# EAGLE board csa_ultrabus_v2 (EAGLE 6.4), part 1 of 2
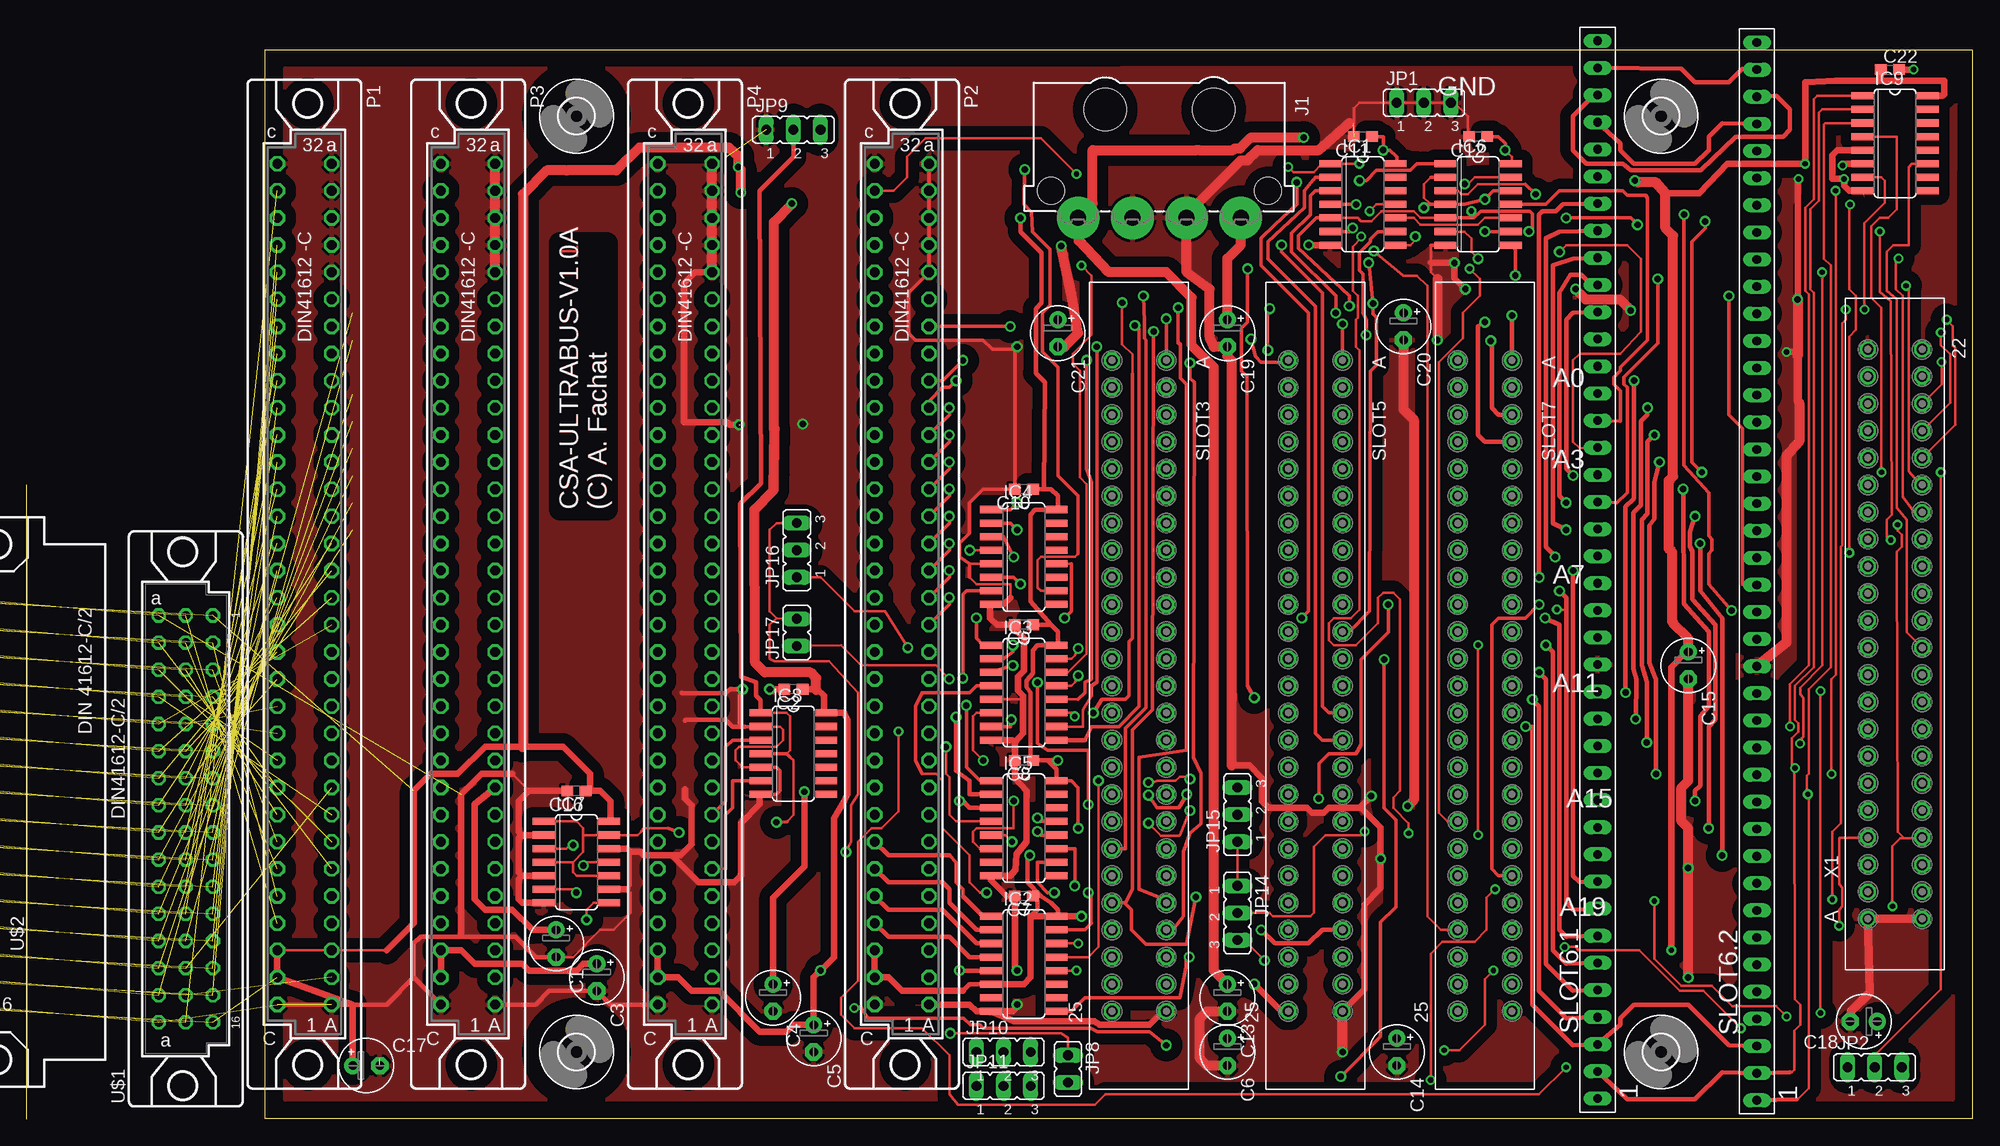
[diagram p5: board, top side]
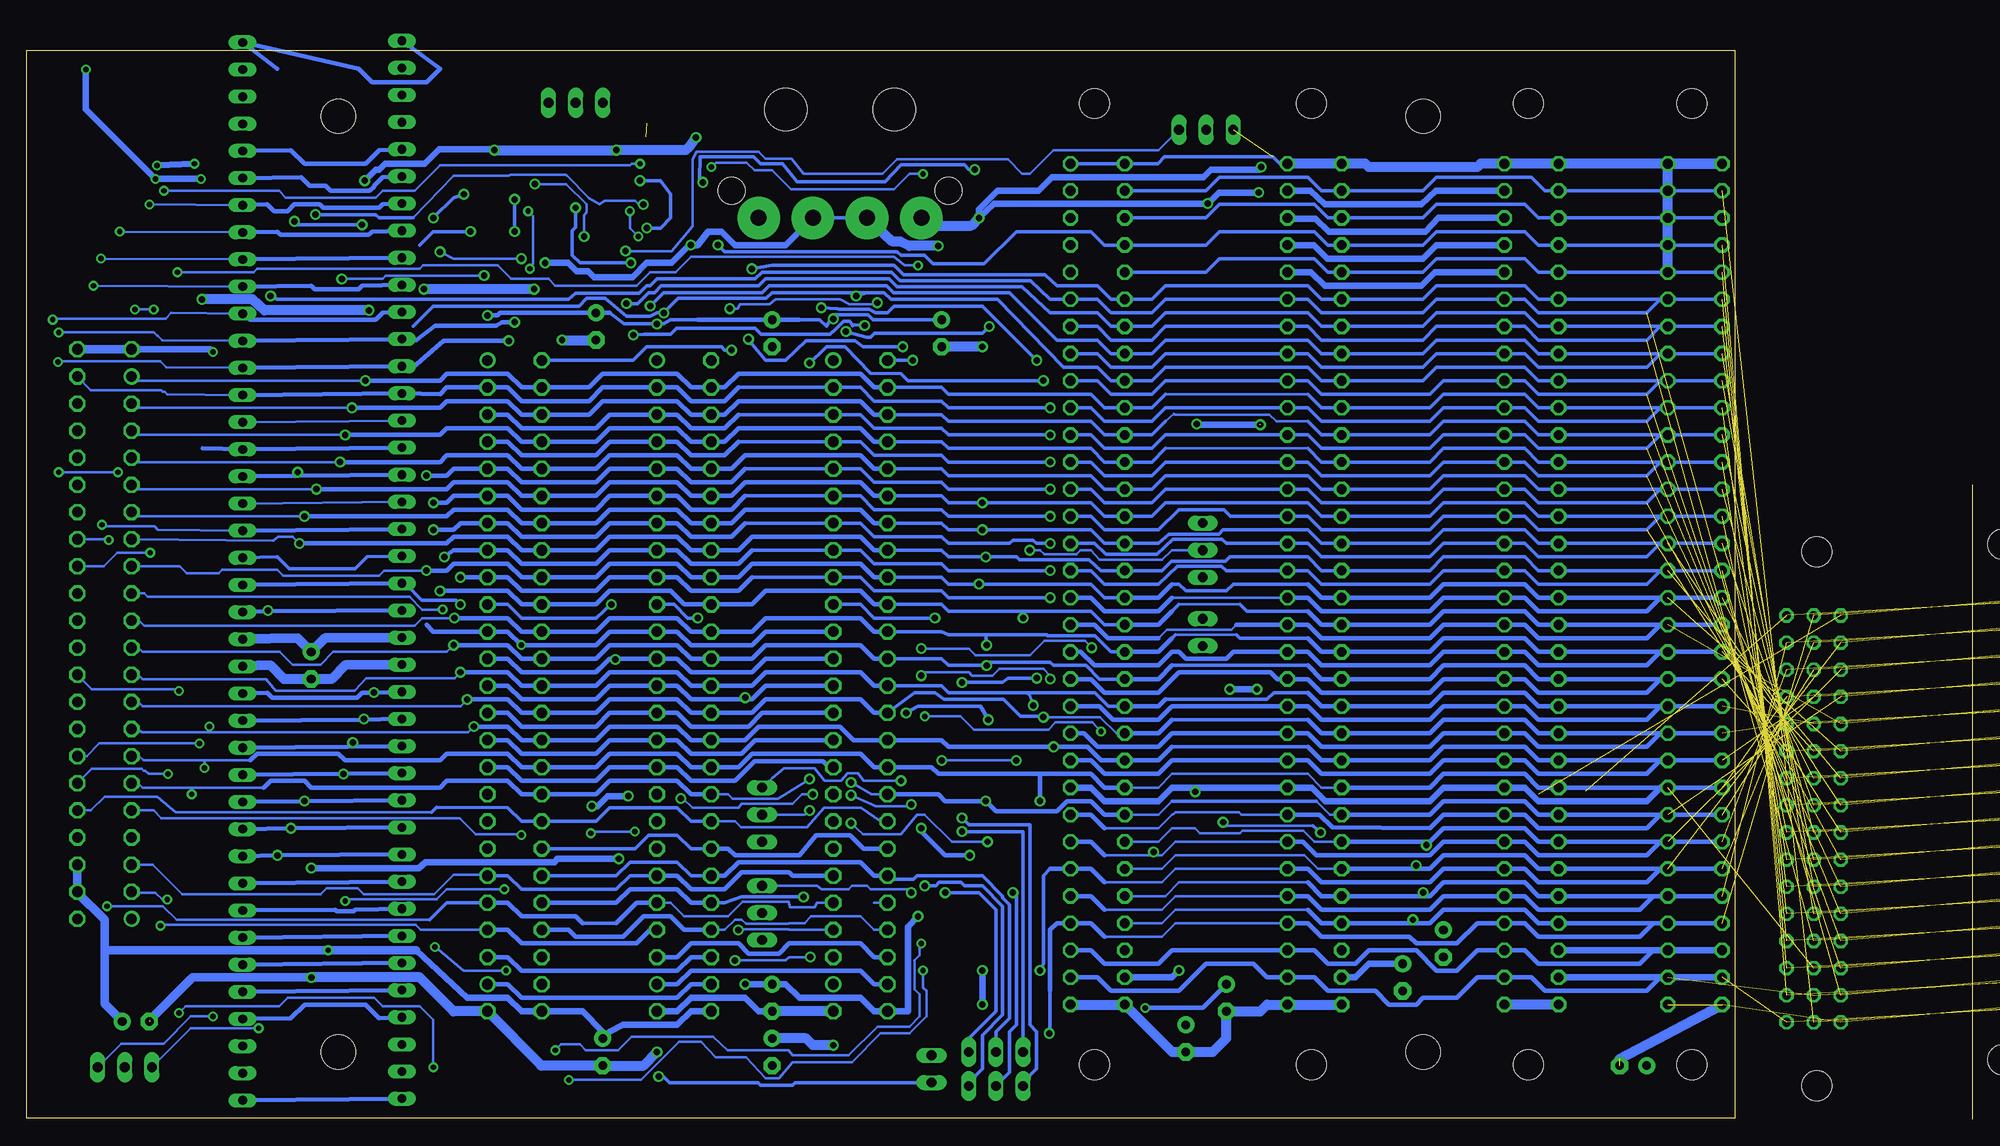
[diagram p6: board, bottom side, seen from below]

Size 160 x 100 mm. Coordinates in mm from the lower left corner, seen from the top.
Outline: 0,0 160,0 160,100 0,100 0,0
Copper layers (1*16): Top 0.035mm / dielectric 1.5mm / Bottom 0.035mm
Design rules "default *": minimum track width 10mil, minimum drill 0.3mm, track to track 6mil, track to pad 6mil, pad to pad 6mil, via to via 6mil, smd to smd 6mil, copper to edge 40mil, drill to drill 8mil, minimum pad ring 10mil, minimum via ring 8mil, stop-mask expansion 4mil, vias tented up to drill 0mil, thermal gap 10mil

## Footprints (pad centres in the part's own frame; a part is rotated, then mirrored left to right if it is on the bottom)
E2,5-5 = drill 0.813 pad 1.6: + -1.27,0 | drill 0.813 pad 1.6 octagon: - 1.27,0
C0603 = smd 1.1 x 1: 1 -0.85,0; 2 0.85,0
3,2 = hole 3.2: 0,0
SO14 = smd 0.66 x 2.032: 1 -3.81,-3.073; 2 -2.54,-3.073; 3 -1.27,-3.073; 4 0,-3.073; 5 1.27,-3.073; 6 2.54,-3.073; 7 3.81,-3.073; 8 3.81,3.073; 9 2.54,3.073; 10 1.27,3.073; 11 0,3.073; 12 -1.27,3.073; 13 -2.54,3.073; 14 -3.81,3.073
SO16 = smd 0.66 x 2.032: 1 -4.445,-3.073; 2 -3.175,-3.073; 3 -1.905,-3.073; 4 -0.635,-3.073; 5 0.635,-3.073; 6 1.905,-3.073; 7 3.175,-3.073; 8 4.445,-3.073; 9 4.445,3.073; 10 3.175,3.073; 11 1.905,3.073; 12 0.635,3.073; 13 -0.635,3.073; 14 -1.905,3.073; 15 -3.175,3.073; 16 -4.445,3.073
827001 = drill 1.5 pad 4: 1 -7.62,0; 2 -2.54,0; 3 2.54,0; 4 7.62,0 | hole 4: 5.08,-10.16; -5.08,-10.16 | hole 2.5: 10.16,-2.54; -10.16,-2.54
JP2 = drill 0.914 long: 1 -2.54,0; 2 0,0; 3 2.54,0
JP1 = drill 0.914 long: 1 0,-1.27; 2 0,1.27
CSABUSSOCK180 = drill 0.914 octagon: A1 -2.54,41.91; A2 -2.54,39.37; A3 -2.54,36.83; A4 -2.54,34.29; A5 -2.54,31.75; A6 -2.54,29.21; A7 -2.54,26.67; A8 -2.54,24.13; A9 -2.54,21.59; A10 -2.54,19.05; A11 -2.54,16.51; A12 -2.54,13.97; A13 -2.54,11.43; A14 -2.54,8.89; A15 -2.54,6.35; A16 -2.54,3.81; A17 -2.54,1.27; A18 -2.54,-1.27; A19 -2.54,-3.81; A20 -2.54,-6.35; A21 -2.54,-8.89; A22 -2.54,-11.43; A23 -2.54,-13.97; A24 -2.54,-16.51; A25 -2.54,-19.05; A26 -2.54,-21.59; A27 -2.54,-24.13; A28 -2.54,-26.67; A29 -2.54,-29.21; A30 -2.54,-31.75; A31 -2.54,-34.29; A32 -2.54,-36.83; C1 2.54,41.91; C2 2.54,39.37; C3 2.54,36.83; C4 2.54,34.29; C5 2.54,31.75; C6 2.54,29.21; C7 2.54,26.67; C8 2.54,24.13; C9 2.54,21.59; C10 2.54,19.05; C11 2.54,16.51; C12 2.54,13.97; C13 2.54,11.43; C14 2.54,8.89; C15 2.54,6.35; C16 2.54,3.81; C17 2.54,1.27; C18 2.54,-1.27; C19 2.54,-3.81; C20 2.54,-6.35; C21 2.54,-8.89; C22 2.54,-11.43; C23 2.54,-13.97; C24 2.54,-16.51; C25 2.54,-19.05; C26 2.54,-21.59; C27 2.54,-24.13; C28 2.54,-26.67; C29 2.54,-29.21; C30 2.54,-31.75; C31 2.54,-34.29; C32 2.54,-36.83 | hole 2.794: -0.305,47.549; -0.305,-42.469
FE100-25 = drill 1 octagon: 1 -29.21,-2.54; 2 -26.67,-2.54; 3 -24.13,-2.54; 4 -21.59,-2.54; 5 -19.05,-2.54; 6 -16.51,-2.54; 7 -13.97,-2.54; 8 -11.43,-2.54; 9 -8.89,-2.54; 10 -6.35,-2.54; 11 -3.81,-2.54; 12 -1.27,-2.54; 13 1.27,-2.54; 14 3.81,-2.54; 15 6.35,-2.54; 16 8.89,-2.54; 17 11.43,-2.54; 18 13.97,-2.54; 19 16.51,-2.54; 20 19.05,-2.54; 21 21.59,-2.54; 22 24.13,-2.54; 23 26.67,-2.54; 24 29.21,-2.54; 25 31.75,-2.54; B -26.67,2.54; C -24.13,2.54; D -21.59,2.54; E -19.05,2.54; F -16.51,2.54; G -13.97,2.54; H -11.43,2.54; J -8.89,2.54; K -6.35,2.54; L -3.81,2.54; M -1.27,2.54; N 1.27,2.54; O 3.81,2.54; P 6.35,2.54; Q 8.89,2.54; R 11.43,2.54; S 13.97,2.54; T 16.51,2.54; U 19.05,2.54; V 21.59,2.54; W 24.13,2.54; X 26.67,2.54; Z 31.75,2.54 | drill 1: A -29.21,2.54; Y 29.21,2.54
SIL40 = drill 0.813 long: 1 -27.94,-1.27; 2 -25.4,-1.27; 3 -22.86,-1.27; 4 -20.32,-1.27; 5 -17.78,-1.27; 6 -15.24,-1.27; 7 -12.7,-1.27; 8 -10.16,-1.27; 9 -7.62,-1.27; 10 -5.08,-1.27; 11 -2.54,-1.27; 12 0,-1.27; 13 2.54,-1.27; 14 5.08,-1.27; 15 7.62,-1.27; 16 10.16,-1.27; 17 12.7,-1.27; 18 15.24,-1.27; 19 17.78,-1.27; 20 20.32,-1.27; 21 22.86,-1.27; 22 25.4,-1.27; 23 27.94,-1.27; 24 30.48,-1.27; 25 33.02,-1.27; 26 35.56,-1.27; 27 38.1,-1.27; 28 40.64,-1.27; 29 43.18,-1.27; 30 45.72,-1.27; 31 48.26,-1.27; 32 50.8,-1.27; 33 53.34,-1.27; 34 55.88,-1.27; 35 58.42,-1.27; 36 60.96,-1.27; 37 63.5,-1.27; 38 66.04,-1.27; 39 68.58,-1.27; 40 71.12,-1.27
FABC48S2 = drill 0.813 octagon: A1 -2.54,19.05; A2 -2.54,16.51; A3 -2.54,13.97; A4 -2.54,11.43; A5 -2.54,8.89; A6 -2.54,6.35; A7 -2.54,3.81; A8 -2.54,1.27; A9 -2.54,-1.27; A10 -2.54,-3.81; A11 -2.54,-6.35; A12 -2.54,-8.89; A13 -2.54,-11.43; A14 -2.54,-13.97; A15 -2.54,-16.51; A16 -2.54,-19.05; B1 0,19.05; B2 0,16.51; B3 0,13.97; B4 0,11.43; B5 0,8.89; B6 0,6.35; B7 0,3.81; B8 0,1.27; B9 0,-1.27; B10 0,-3.81; B11 0,-6.35; B12 0,-8.89; B13 0,-11.43; B14 0,-13.97; B15 0,-16.51; B16 0,-19.05; C1 2.54,19.05; C2 2.54,16.51; C3 2.54,13.97; C4 2.54,11.43; C5 2.54,8.89; C6 2.54,6.35; C7 2.54,3.81; C8 2.54,1.27; C9 2.54,-1.27; C10 2.54,-3.81; C11 2.54,-6.35; C12 2.54,-8.89; C13 2.54,-11.43; C14 2.54,-13.97; C15 2.54,-16.51; C16 2.54,-19.05 | hole 2.794: -0.305,-25; -0.305,25
MABC48B2 = drill 1.016 octagon: A1 -5.08,19.05; A2 -5.08,16.51; A3 -5.08,13.97; A4 -5.08,11.43; A5 -5.08,8.89; A6 -5.08,6.35; A7 -5.08,3.81; A8 -5.08,1.27; A9 -5.08,-1.27; A10 -5.08,-3.81; A11 -5.08,-6.35; A12 -5.08,-8.89; A13 -5.08,-11.43; A14 -5.08,-13.97; A15 -5.08,-16.51; A16 -5.08,-19.05; B1 -7.62,19.05; B2 -7.62,16.51; B3 -7.62,13.97; B4 -7.62,11.43; B5 -7.62,8.89; B6 -7.62,6.35; B7 -7.62,3.81; B8 -7.62,1.27; B9 -7.62,-1.27; B10 -7.62,-3.81; B11 -7.62,-6.35; B12 -7.62,-8.89; B13 -7.62,-11.43; B14 -7.62,-13.97; B15 -7.62,-16.51; B16 -7.62,-19.05; C1 -10.16,19.05; C2 -10.16,16.51; C3 -10.16,13.97; C4 -10.16,11.43; C5 -10.16,8.89; C6 -10.16,6.35; C7 -10.16,3.81; C8 -10.16,1.27; C9 -10.16,-1.27; C10 -10.16,-3.81; C11 -10.16,-6.35; C12 -10.16,-8.89; C13 -10.16,-11.43; C14 -10.16,-13.97; C15 -10.16,-16.51; C16 -10.16,-19.05 | hole 2.794: -2.54,24.13; -2.54,-24.13
FE100-22-2 = drill 1 octagon: 1 -26.67,-2.54; 2 -24.13,-2.54; 3 -21.59,-2.54; 4 -19.05,-2.54; 5 -16.51,-2.54; 6 -13.97,-2.54; 7 -11.43,-2.54; 8 -8.89,-2.54; 9 -6.35,-2.54; 10 -3.81,-2.54; 11 -1.27,-2.54; 12 1.27,-2.54; 13 3.81,-2.54; 14 6.35,-2.54; 15 8.89,-2.54; 16 11.43,-2.54; 17 13.97,-2.54; 18 16.51,-2.54; 19 19.05,-2.54; 20 21.59,-2.54; 21 24.13,-2.54; 22 26.67,-2.54; B -24.13,2.54; C -21.59,2.54; D -19.05,2.54; E -16.51,2.54; F -13.97,2.54; H -11.43,2.54; J -8.89,2.54; K -6.35,2.54; L -3.81,2.54; M -1.27,2.54; N 1.27,2.54; P 3.81,2.54; R 6.35,2.54; S 8.89,2.54; T 11.43,2.54; U 13.97,2.54; V 16.51,2.54; W 19.05,2.54; X 21.59,2.54; Z 26.67,2.54 | drill 1: A -26.67,2.54; Y 24.13,2.54

## Placement (x,y rotation side)
C1  47u  [E2,5-5]  27.3,16.34 270 top
C2  [C0603]  49.53,40.16 180 top
C3  47u  [E2,5-5]  31.11,13.17 270 top
C4  47u  [E2,5-5]  47.62,11.27 270 top
C5  47u  [E2,5-5]  51.43,7.46 270 top
C6  47u  [E2,5-5]  90.16,6.18 270 top
C7  [C0603]  71.11,20.79 180 top
C8  [C0603]  71.11,33.49 180 top
C9  [C0603]  71.11,46.19 180 top
C10  [C0603]  71.11,58.89 180 top
C11  [C0603]  102.86,91.91 180 top
C12  [C0603]  113.66,91.91 180 top
C13  47u  [E2,5-5]  90.16,11.27 270 top
C14  47u  [E2,5-5]  106.04,6.18 270 top
C15  47u  [E2,5-5]  133.34,42.38 270 top
C16  [C0603]  29.2,30.63 180 top
C17  47u  [E2,5-5]  9.52,4.92 0 top
C18  47u  [E2,5-5]  149.78,9.04 180 top
C19  47u  [E2,5-5]  90.16,73.5 270 top
C20  47u  [E2,5-5]  106.67,74.13 270 top
C21  47u  [E2,5-5]  74.29,73.5 270 top
C22  [C0603]  152.24,98.18 0 top
C23  47u  [E2,5-5]  -31.12,-3.18 0 top  (outside the outline)
C24  47u  [E2,5-5]  -31.12,-9.13 0 top  (outside the outline)
H1  MOUNT-HOLE3.2  [3,2]  29.2,93.81 0 top
H2  MOUNT-HOLE3.2  [3,2]  29.2,6.18 0 top
H3  MOUNT-HOLE3.2  [3,2]  130.81,93.81 0 top
H4  MOUNT-HOLE3.2  [3,2]  130.81,6.18 0 top
IC1  74AC04D  [SO14]  102.86,85.56 270 top
IC2  74AC138D  [SO16]  71.11,14.44 270 top
IC3  74AC138D  [SO16]  71.11,39.84 270 top
IC4  74AC138D  [SO16]  71.11,52.54 270 top
IC5  74AC138D  [SO16]  71.11,27.14 270 top
IC6  74HCT00D  [SO14]  113.66,85.56 270 top
IC7  74HCT125D  [SO14]  29.2,23.96 270 top
IC8  74HCT125D  [SO14]  49.53,34.12 270 top
IC9  74AC138D  [SO16]  152.71,91.28 270 top
J1  [827001]  83.81,84.29 180 top
JP1  [JP2]  108.58,95.08 0 top
JP2  [JP2]  150.81,4.76 0 top
JP8  [JP1]  75.24,4.6 180 top
JP9  [JP2]  49.53,92.55 0 top
JP10  [JP2]  69.21,6.18 0 top
JP11  [JP2]  69.21,3.01 0 top
JP14  [JP2]  91.12,19.2 270 top
JP15  [JP2]  91.12,28.41 90 top
JP16  [JP2]  49.84,53.17 90 top
JP17  [JP1]  49.84,45.48 0 top
P1  CSABUSSOCK180  [CSABUSSOCK180]  3.73,52.54 180 top
P2  CSABUSSOCK180  [CSABUSSOCK180]  59.69,52.54 180 top
P3  CSABUSSOCK180  [CSABUSSOCK180]  19.04,52.54 180 top
P4  CSABUSSOCK180  [CSABUSSOCK180]  39.37,52.54 180 top
SLOT3  A2SLOT  [FE100-25]  81.91,41.74 270 top
SLOT5  A2SLOT  [FE100-25]  98.42,41.74 270 top
SLOT6.1  RC2014/6502  [SIL40]  123.58,29.76 90 top
SLOT6.2  RC2014/6502  [SIL40]  138.5,29.6 90 top
SLOT7  A2SLOT  [FE100-25]  114.3,41.74 270 top
U$1  CSASHORTBUSFS  [FABC48S2]  -7.39,28.01 0 top  (outside the outline)
U$2  CSASHORTBUSMA  [MABC48B2]  -22.55,29.6 0 top  (outside the outline)
X1  PORT_EXPANSION_64_CONN  [FE100-22-2]  152.71,45.32 90 top

## Tracks (layer width: path | path; a pad name or v marks a point on that pad's centre or on a via)
8MHZ
  Top 0.305: IC1.2 98.42,88.1 97.39,86.83 97.39,85.24 93.97,82.07 93.97,80.48 98.42,76.03 98.42,36.03 99.05,35.39 SLOT5.P
  Bottom 0.406: SLOT3.P 91.75,35.39 93.02,34.12 97.78,34.12 99.05,35.39 SLOT5.P 105.41,35.39 106.67,34.12 113.66,34.12 114.93,35.39 SLOT7.P
12V  (via drill 0.6)
  Top 0.305: v100.96,74.37 SLOT5.A | SLOT3.A v84.45,74.84
  Top 0.406: v116.83,75.16 SLOT7.A
  Top 0.914: C19.+ 90.16,80.48 91.44,81.75 J1.1
  Bottom 0.305: C21.+ 80.72,74.77 81.2,75.24 84.45,75.24 | 97.15,74.77 99.69,74.77 100.32,74.37 v100.96,74.37 104.06,74.37 105.41,75.4 | 84.45,75.24 85.08,74.13 85.72,74.77 87.62,74.77 | v84.45,74.84 84.45,75.24
  Bottom 0.406: 87.62,74.77 C19.+ 97.15,74.77 | 105.41,75.4 C20.+ 115.64,75.4 115.88,75.16 v116.83,75.16
16MHZ
  Bottom 0.305: P1.C30 P3.C30 18.41,84.29 19.68,85.56 27.93,85.56 29.2,84.29 P4.C30 38.1,84.29 39.37,85.56 48.26,85.56 49.53,84.29 P2.C30
50HZ
  Bottom 0.406: P1.A3 7.62,15.71 8.89,14.44 18.41,14.44 19.68,15.71 P3.A3 24.12,15.71 26.03,13.81 27.93,13.81 29.84,15.71 34.29,15.71 35.55,14.44 38.1,14.44 39.37,15.71 P4.A3 52.7,15.71 53.97,14.44 59.05,14.44 60.32,15.71 P2.A3
/BANK0  (via drill 0.6)
  Top 0.254: 77.46,18.25 77.46,20.79 v77.15,21.11 | JP14.1 JP15.1
  Top 0.305: IC2.15 76.83,17.61 77.46,18.25
  Bottom 0.254: v77.15,21.11 77.46,21.42 80.96,21.42 81.27,21.74 82.7,21.74 83.02,21.42 85.56,21.42 85.96,21.74 JP14.1
/BANK1  (via drill 0.5)
  Top 0.254: IC2.14 v76.19,16.34 | v110.48,6.34 111.91,6.34 114.3,8.73 114.3,13.01 v115.09,13.81 | v121.76,16.03 122.87,16.03 123.03,15.71 128.74,15.71 132.55,11.9 134.77,11.9 v138.27,8.41
  Bottom 0.254: v76.19,16.34 76.35,16.34 76.35,15.23 76.83,14.76 76.83,12.06 76.35,11.58 76.35,9.52 77.31,8.57 80.32,8.57 83.02,5.87 88.26,5.87 88.66,6.34 94.37,6.34 95.72,7.61 103.34,7.61 104.61,6.34 107.63,6.34 108.18,6.9 109.93,6.9 v110.48,6.34 | v115.09,13.81 119.06,13.81 v121.76,16.03 | v138.27,8.41 144.62,8.41 JP2.1
/BANK2  (via drill 0.6)
  Top 0.254: IC2.13 77.15,15.08 78.1,16.03 v78.1,31.58
  Bottom 0.254: v78.1,31.58 81.59,31.58 82.15,32.3 83.1,32.3 83.74,31.58 85.24,31.58 86.2,32.78 89.05,32.78 90.16,31.82 JP15.3
/BANK3  (via drill 0.5)
  Top 0.254: IC2.12 v76.04,13.81 | v109.21,3.57 109.21,15.39 110.33,16.5 113.34,16.5 114.45,17.61 114.45,20.63 v115.25,21.42 | v130.17,20.31 130.17,14.92 132.71,12.38 135.57,12.38 137.47,10.47 141.6,10.47 v142.55,9.52
  Bottom 0.254: v76.04,13.81 76.04,12.22 75.72,11.9 75.72,9.52 77.31,7.93 80,7.93 82.7,5.23 88.26,5.23 89.53,3.72 90.8,3.72 92.63,5.71 95.48,5.71 96.83,7.14 98.9,7.14 102.47,3.57 v109.21,3.57 | v115.25,21.42 120.64,21.42 121.6,20.47 130.01,20.47 v130.17,20.31 | v142.55,9.52 144.62,9.52 147.16,6.98 151.12,6.98 JP2.3
/BANK6  (via drill 0.6)
  Top 0.254: v93.66,14.76 91.75,16.66 JP14.3
  Top 0.305: IC2.9 75.56,10 76.83,11.27 85.72,11.27 86.28,14.12 86.28,14.76 v86.59,15.08
  Bottom 0.254: v86.59,15.08 88.58,15.08 88.89,14.76 v93.66,14.76
/BE  (2 unrouted)
  Top 0.305: P4.A8 43.18,29.68 43.18,34.76 43.81,35.39 IC8.3
  Bottom 0.254: 59.05,27.14 53.97,27.14 52.7,28.41 52.54,28.49 52.38,28.65 46.43,28.65 46.19,28.41 P4.A8
  Bottom 0.406: P1.A8 6.98,28.41 8.25,27.14 18.41,27.14 19.68,28.41 P3.A8 27.3,28.41 28.57,27.14 37.7,27.22 38.89,28.41 P4.A8 | 59.05,27.14 60.32,28.41 P2.A8
/DMA  (via drill 0.6)
  Top 0.254: SLOT7.22 110.17,17.61 108.9,18.88 108.9,77.94 107.94,78.89 106.67,78.89 v103.9,81.19
  Bottom 0.254: SLOT3.22 80.64,17.61 81.91,18.88 86.51,18.88 87.15,18.25 88.58,18.25 88.66,18.17 92.63,18.17 93.02,18.57 93.66,18.57 94.61,17.61 SLOT5.22 | v103.9,81.19 99.61,81.19 97.63,83.5 97.63,89.77 97.23,90.48 91.44,90.48 90.8,89.85 88.34,89.85 87.23,88.42 79.85,88.42 78.5,89.77 68.1,89.77 66.75,88.42 66.03,88.42 63.81,90.64 53.97,90.64 JP9.3
  Bottom 0.406: SLOT5.22 98.42,17.61 99.69,18.88 102.23,18.88 104.13,16.98 108.58,16.98 109.21,17.61 SLOT7.22
/EXTIO
  Bottom 0.254: P4.A5 52.38,20.79 53.65,19.52 59.05,19.52
  Bottom 0.406: P1.A5 7.62,20.79 8.89,19.52 18.41,19.52 19.68,20.79 P3.A5 27.3,20.79 28.57,19.52 38.73,19.52 40,20.79 P4.A5 | 59.05,19.52 60.32,20.79 P2.A5
/IOINH  (via drill 0.6)
  Top 0.254: JP8.1 75.24,7.53 74.61,7.93 v64.21,7.93
  Bottom 0.254: P4.A4 52.38,18.25 53.65,16.98 59.05,16.98 | v64.21,7.93 64.29,7.85 64.13,7.69
  Bottom 0.305: 64.13,11.9 64.13,7.69
  Bottom 0.406: P1.A4 7.62,18.25 8.89,16.98 18.41,16.98 19.68,18.25 P3.A4 24.12,18.25 26.03,16.34 29.84,16.34 30.47,16.98 38.73,16.98 40,18.25 P4.A4 | 59.05,16.98 60.32,18.25 P2.A4 63.5,18.25 64.13,17.61 64.13,11.9
/IOSEL  (via drill 0.6)  (2 unrouted)
  Top 0.254: 47.94,46.82 47.3,47.46 47.3,55.08 47.94,55.71 JP16.3 | JP17.2 47.94,46.82 | 47.94,46.82 47.3,46.19 47.3,43.02 47.78,42.78 52.86,42.78 55.56,39.84 55.56,30.31 54.92,29.28 54.92,25.87 v54.45,24.92
  Bottom 0.254: P4.A7 52.38,25.87 53.65,24.6 54.53,24.6 | 54.53,24.6 59.05,24.6 | v54.45,24.92 54.53,24.6
  Bottom 0.406: P1.A7 6.98,25.87 8.25,24.6 18.41,24.6 19.68,25.87 P3.A7 27.3,25.87 28.57,24.6 39.21,24.6 40.48,25.87 P4.A7 | 59.05,24.6 60.32,25.87 P2.A7
/IOSTROBE
  Bottom 0.305: SLOT5.20 97.78,22.7 99.05,23.96 103.5,23.96 104.77,22.7 SLOT7.20 | JP10.2 69.21,8.09 67.94,9.36 67.94,20 68.57,20.63 68.57,20.79 70.48,22.7 76.59,22.7 76.91,22.38 79.05,22.38 SLOT3.20
  Bottom 0.406: SLOT3.20 80.64,22.7 81.91,23.96 93.34,23.96 94.61,22.7 SLOT5.20
/IRQ  (via drill 0.5, 0.6)  (2 unrouted)
  Top 0.254: v152.47,19.84 152.47,25.47 153.19,26.19 153.59,26.19 | 153.59,26.19 155.17,26.19 X1.4 | v152.95,55.56 152.95,55 153.35,54.6 153.35,53.49 152.87,53.02 152.95,26.82 153.59,26.19
  Top 0.305: SLOT3.V 85.08,20.15 81.91,21.42 81.91,33.81 86.35,34.44 86.35,68.73 85.8,69.29 85.8,72.46 85.56,72.62 v85.56,75.88 | P2.A24 63.5,69.05 v65.4,70.95
  Bottom 0.254: SLOT3.V 85.96,20.15 86.2,19.76 88.5,19.76 88.66,20.23 92.94,20.23 94.29,18.88 98.42,18.88 99.69,20.15 SLOT5.V | 122.23,18.57 145.97,18.57 147.24,19.84 v152.47,19.84 | SLOT6.2.22 147.71,55.08 148.03,55.4 152.79,55.4 v152.95,55.56
  Bottom 0.305: P1.A24 6.98,69.05 8.25,67.78 18.41,67.78 19.68,69.05 P3.A24 27.3,69.05 28.57,67.78 38.73,67.78 40,69.05 P4.A24 53.34,69.05 54.61,67.78 58.41,67.78 59.69,69.05 P2.A24 | 104.77,18.25 107.94,18.25 | v65.4,70.95 70.48,76.03 78.73,76.03 79.37,75.4 80.48,75.4 81.12,75.72 83.89,75.72 84.05,75.8 v85.56,75.88 | SLOT7.V 120.64,20.15 122.23,18.57
  Bottom 0.406: SLOT5.V 102.86,20.15 104.77,18.25 | 107.94,18.25 108.58,18.88 113.66,18.88 114.93,20.15 SLOT7.V | SLOT6.1.22 SLOT6.2.22
/M1  (via drill 0.6)
  Top 0.305: IC1.4 v102.23,85.56 | v132.95,84.61 132.95,61.11 135.25,58.57 135.25,54.52 135.57,54.21 135.57,53.17 135.25,52.86 135.25,50 v137.39,47.54
  Bottom 0.254: v102.23,85.56 102.71,85.56 103.02,85.88 105.88,85.88 106.36,85.56 107.31,86.12 109.37,88.26 109.53,88.34 114.69,88.34 114.85,88.26 120.01,88.26 123.82,84.29
  Bottom 0.305: 123.82,84.29 126.99,84.29 127.31,84.61 v132.95,84.61 | v137.39,47.54 137.23,47.46
  Bottom 0.406: SLOT6.1.19 137.23,47.46 SLOT6.2.19
/MEMSEL  (via drill 0.6)  (2 unrouted)
  Top 0.254: 43.18,23.33 P4.A6
  Top 0.305: 43.18,23.33 43.18,28.41 43.81,29.04 43.81,31.58 IC8.6
  Top 0.406: IC2.5 v65.08,13.81
  Bottom 0.254: P4.A6 52.38,23.33 53.65,22.06 59.05,22.06
  Bottom 0.305: 64.13,23.33 64.77,22.7 64.77,14.44 v65.08,13.81
  Bottom 0.406: P1.A6 6.98,23.33 8.25,22.06 18.41,22.06 19.68,23.33 P3.A6 27.3,23.33 28.57,22.06 38.73,22.06 40,23.33 P4.A6 | 59.05,22.06 60.32,23.33 P2.A6 64.13,23.33
/NMI  (via drill 0.5, 0.6)  (2 unrouted)
  Top 0.254: v147.47,18.01 147.47,19.52 147.79,19.84 147.79,21.58 147.47,21.9 147.47,26.19 147.55,26.27 X1.D
  Top 0.305: SLOT3.W 85.08,17.61 86.04,18.88 86.04,24.92 86.67,26.66 87.7,27.54 87.7,32.3 86.99,33.81 87.07,68.89 86.67,69.29 v86.67,70.72 | P2.A23 62.23,67.14 63.5,68.41 64.13,68.41 v64.77,69.05
  Top 0.406: v93.34,17.61 94.61,16.34 97.78,16.34 99.05,17.61 SLOT5.W
  Bottom 0.254: SLOT3.W 88.58,17.61 88.66,17.69 93.18,17.69 93.26,17.61 v93.34,17.61 | SLOT7.W 123.11,17.61 123.58,18.09 147.39,18.09 v147.47,18.01
  Bottom 0.305: P1.A23 6.98,66.51 8.25,65.24 18.41,65.24 19.68,66.51 P3.A23 27.3,66.51 28.57,65.24 38.73,65.24 40,66.51 P4.A23 53.34,66.51 54.61,65.24 59.05,65.24 60.32,66.51 P2.A23 | v64.77,69.05 77.46,69.05 78.1,69.69 80.96,69.76 83.34,72.22 85.08,72.22 85.72,71.59 v86.67,70.72
  Bottom 0.406: SLOT5.W 101.59,17.61 102.86,16.34 113.66,16.34 114.93,17.61 SLOT7.W
/RD0  (via drill 0.6)
  Top 0.254: IC6.6 112.39,83.02 113.02,82.39 113.02,81.11 v113.66,80.48 | v121.28,81.11 121.91,81.75 127.63,81.75 128.9,80.48 128.9,73.65 126.99,71.59 123.19,71.59 122.55,70.95 122.55,63.34 123.19,62.7 SLOT6.1.25
  Bottom 0.254: v113.66,80.48 120.01,80.48 v121.28,81.11
  Bottom 0.406: SLOT6.1.25 SLOT6.2.25 143.5,62.7
/RES  (via drill 0.6)  (2 unrouted)
  Top 0.305: v137.16,76.99 137.16,65.88 138.42,64.61 138.42,50 SLOT6.2.20 | SLOT7.U 115.56,22.7 114.93,23.33 114.93,46.19 115.56,46.82 118.1,46.82 v119.38,48.09
  Bottom 0.254: X1.C 148.19,23.73 145.41,20.95 132.47,20.95 131.92,21.5 128.98,21.5 128.42,20.95 121.84,20.95 120.01,22.77 116.91,22.77 SLOT7.U
  Bottom 0.305: P1.A27 6.98,76.67 8.25,75.4 18.41,75.4 19.68,76.67 P3.A27 27.93,76.67 29.2,75.4 38.73,75.4 40,76.67 P4.A27 53.34,76.67 54.61,75.4 58.41,75.4 59.69,76.67 P2.A27 64.13,76.67 65.96,78.42 78.18,78.42 78.97,79.21 91.12,79.21 91.75,78.58 100.96,78.58 101.59,77.94 101.91,77.94 102.63,77.23 108.58,77.23 109.21,76.67 136.6,76.67 136.92,76.99 v137.16,76.99 | SLOT5.U 103.5,22.7 104.77,21.42 113.66,21.42 114.93,22.7 SLOT7.U | v119.38,48.09 119.77,48.49 123.03,48.49 124.45,50 SLOT6.1.20
  Bottom 0.406: SLOT3.U 88.26,22.7 88.58,23.01 93.02,23.01 94.61,21.42 97.78,21.42 99.05,22.7 SLOT5.U | SLOT6.1.20 SLOT6.2.20
/SLOT0IO  (via drill 0.6)
  Top 0.254: IC3.15 75.56,43.02 75.88,43.33 v76.19,43.97 | v60.24,44.05 58.1,47.46 55.24,47.46 52.07,50.63 JP16.1
  Bottom 0.254: v76.19,43.97 71.75,43.97 71.11,43.33 66.03,43.33 64.69,44.68 60.88,44.68 v60.24,44.05
/SLOT1IO  (via drill 0.5)
  Top 0.254: IC3.14 75.24,41.74 76.99,43.49 76.99,59.37 76.35,60 76.35,70 75.72,70.64 75.72,71.59 77.46,73.34 77.46,78.89 v76.51,79.84 | v145.89,79.21 145.89,42.38 143.82,40.32 143.82,39.68 144.14,39.36 144.14,35.71 143.82,35.39 v143.82,35.08
  Bottom 0.254: X1.7 154.38,33.89 153.19,35.08 v143.82,35.08 | v76.51,79.84 77.78,79.84 78.73,80.64 97.78,80.64 99.21,79.21 101.59,79.21 102.86,77.94 110.48,77.94 111.12,78.58 114.61,78.58 115.88,79.84 122.87,79.84 123.19,79.53 138.42,79.53 138.74,79.21 v145.89,79.21
/SLOT2IO  (via drill 0.6)
  Top 0.254: JP17.1 53.97,44.28 55.88,42.38 62.86,42.38 v64.13,41.11 | v76.19,41.43 75.88,40.79 75.56,40.48 IC3.13
  Bottom 0.254: v64.13,41.11 64.13,41.43 64.77,42.06 68.89,42.06 69.53,41.43 71.43,41.43 71.75,41.74 75.88,41.74 v76.19,41.43
/SLOT3IO  (via drill 0.6)
  Top 0.254: IC3.12 76.19,39.2
  Top 0.305: 76.19,39.2 76.83,39.84 76.83,40.79 77.46,41.11 77.46,59.52 76.99,60.8 v76.99,70.95
  Bottom 0.305: v76.99,70.95 SLOT3.1
/SLOT4IO  (via drill 0.5)
  Top 0.254: IC3.11 75.56,37.94 v75.88,37.62 | v59.37,36.19 59.37,28.73 57.78,27.14 56.83,27.14 55.56,25.87 55.56,12.85 53.97,11.27 53.97,9.68 55.24,8.41 61.59,8.41 64.13,5.87 64.13,2.22 64.92,1.26 77.78,1.26 78.73,2.22 119.38,2.22 v121.91,4.76 | v145.73,9.84 v145.73,40
  Bottom 0.254: v75.88,37.62 72.54,37.62 71.27,36.35 64.29,36.35 63.65,37.06 60.16,37.06 v59.37,36.19 | v121.91,4.76 121.91,9.2 123.19,10.47 126.68,10.47 127.47,11.27 135.57,11.27 136.36,10.47 145.09,10.47 v145.73,9.84 | v145.73,40 145.89,40 146.04,40.16 153.9,40.16 X1.10
/SLOT5IO  (via drill 0.6)
  Top 0.254: IC3.10 76.67,36.66 76.67,38.25 77.46,39.52
  Top 0.305: 77.46,39.52 77.46,40.48 77.94,40.79 v77.94,72.22 | v92.39,72.94 92.78,71.35 93.34,70.8 95.8,70.8 95.88,70.88 SLOT5.1
  Bottom 0.305: v77.94,72.22 81.67,72.22 82.39,72.78 86.99,72.78 88.89,70.95 90.8,70.95 92.07,72.46 v92.39,72.94
/SLOT6.X_BANK  (via drill 0.6)
  Top 0.305: SLOT6.1.23 126.68,57.62 127.63,58.57 127.63,68.41 127.31,68.73 127.31,69.37 130.49,72.54 v130.49,78.58 | v117.15,78.89 117.15,81.33 IC6.8
  Bottom 0.254: v130.49,78.58 126.68,78.58 126.36,78.89 v117.15,78.89 | SLOT6.2.23 SLOT6.1.23
/SLOT6.X_IO
  Top 0.305: IC6.11 120.01,85.56 121.28,86.83 127.23,86.83 127.63,86.43 129.38,86.43 129.53,86.19 129.53,72.86 126.99,70.32 126.99,70 126.36,69.37 126.36,68.73 126.99,68.1 126.99,65.24 SLOT6.1.26
  Bottom 0.254: SLOT6.2.26 SLOT6.1.26
/SLOT6IO  (via drill 0.6)
  Top 0.305: 76.83,35.39 77.46,36.66 80,36.66 81.91,38.57 81.91,73.97 81.59,73.89 v81.51,74.21 | IC1.9 104.29,83.02 103.58,82.31 103.58,82.07 102.55,81.04 102.55,79.37 102.86,79.05 102.86,77.46 102.86,75.4 103.18,74.77 v103.18,73.34
  Top 0.406: 76.83,35.39 IC3.9
  Bottom 0.305: v81.51,74.21 82.47,74.29 82.62,74.21 82.62,74.29 82.94,74.61 83.5,74.61 84.45,73.65 84.53,73.65 84.77,73.42 91.2,73.42 91.75,73.97 99.13,73.97 99.69,73.42 102.15,73.42 v103.18,73.34
/SLOT7IO  (via drill 0.6)
  Top 0.254: v93.97,71.91 93.97,75.24 94.13,75.4 v94.13,75.8 | v80.32,76.35 80.32,72.46 81.27,71.51 81.27,69.69
  Top 0.305: IC3.7 69.84,36.66 v69.92,37.3 | v77.62,37.94 78.42,39.2 80.64,39.2 80.96,39.52 80.96,44.6 81.27,44.92 81.27,69.69
  Bottom 0.254: v94.13,75.8 93.42,75.8 93.18,76.19 90.4,76.19 89.85,76.67 83.81,76.67 82.94,76.19 80.88,76.19 v80.32,76.35
  Bottom 0.305: SLOT7.1 103.18,70.95 101.91,72.22 94.93,72.22 94.61,71.91 v93.97,71.91 | v69.92,37.3 70.64,38.57 76.51,38.57 v77.62,37.94
/SLOTIO  (via drill 0.6)
  Top 0.254: v67.62,21.11 66.99,21.11 66.03,22.06 66.03,24.6 63.5,27.14 63.5,31.58 62.86,32.22 61.59,32.22
  Top 0.305: 61.59,32.22 60.96,33.49 60.96,38.57 61.59,39.84 66.03,39.84 66.67,40.48 IC3.4
  Bottom 0.305: JP11.2 67.94,4.28 67.94,8.09 67.3,8.73 67.3,20.79 v67.62,21.11
/SO
  Bottom 0.305: P1.A25 6.98,71.59 8.25,70.32 18.41,70.32 19.68,71.59 P3.A25 27.93,71.59 29.2,70.32 38.73,70.32 40,71.59 P4.A25 53.34,71.59 54.61,70.32 58.41,70.32 59.69,71.59 P2.A25
/WR0  (via drill 0.6)
  Top 0.254: IC6.3 111.75,86.83 112.07,86.51 112.71,86.51 113.66,87.47 118.1,87.47
  Top 0.305: 118.1,87.47 v119.06,86.51 | v121.91,84.29 127.95,84.29 v128.58,83.66 | v134.93,83.97 134.93,83.34 133.66,82.07 133.66,61.43 v134.62,60.48
  Bottom 0.305: v119.06,86.51 120.01,86.19 v121.91,84.29 | v128.58,83.66 134.62,83.66 v134.93,83.97 | v134.62,60.48 134.62,60.16
  Bottom 0.406: SLOT6.1.24 134.62,60.16 SLOT6.2.24
A2USER1  (via drill 0.6)
  Top 0.305: v100.8,3.88 104.53,7.61 104.53,18.33 105.96,19.76 105.96,27.93 104.85,29.04 v104.85,42.94
  Bottom 0.305: JP8.2 88.02,3.33 88.26,3.09 91.28,3.09 91.51,3.33 99.77,3.33 100.32,3.88 v100.8,3.88 | v104.85,42.94 105.48,42.94 106.83,41.74
  Bottom 0.406: SLOT3.M 90.8,43.02 92.07,41.74 97.78,41.74 99.05,43.02 SLOT5.M 105.41,43.02 105.48,42.94 106.67,41.74 106.83,41.74 113.66,41.74 114.93,43.02 SLOT7.M
B2PHI2  (via drill 0.6)  (2 unrouted)
  Top 0.305: v95.24,81.75 95.24,81.11 99.05,77.3 99.05,38.57 99.69,37.94 SLOT5.O
  Bottom 0.305: P1.C29 P3.C29 18.41,81.75 19.68,83.02 27.93,83.02 29.2,81.75 P4.C29 38.1,81.75 39.37,83.02 48.26,83.02 49.53,81.75 P2.C29 59.05,81.75 60.32,83.02 67.3,83.02 70.32,80 75.08,80 75.88,80.8 78.1,80.8 78.5,81.11 94.61,81.11 v95.24,81.75
  Bottom 0.406: SLOT3.O 91.12,37.94 92.39,36.66 97.78,36.66 99.05,37.94 SLOT5.O 105.41,37.94 106.67,36.66 113.66,36.66 114.93,37.94 SLOT7.O
B8PHI2  (via drill 0.5)  (2 unrouted)
  Top 0.254: P2.C31 58.89,86.83 60.16,88.1 60.16,90 61.91,91.75 72.7,91.75 v76.04,88.42 | v95.88,89.05 96.36,88.58 98.26,88.58 98.9,89.21 99.63,89.21 IC1.1 v102.55,89.37 | v147.16,86.83 147.16,41.51 146.76,41.11 v146.76,32.22
  Bottom 0.254: v76.04,88.42 77.31,88.42 78.73,86.99 88.42,86.99 90.16,88.73 91.83,88.73 92.55,89.45 95.4,89.45 95.8,89.05 v95.88,89.05 | v102.55,89.37 103.34,89.37 103.5,89.21 121.28,89.21 123.66,86.83 126.68,86.83 127.31,86.19 135.73,86.19 136.36,86.83 v147.16,86.83 | v146.76,32.22 148.59,32.22 148.9,32.54 149.06,32.54 149.22,32.7 153.9,32.7 X1.6
  Bottom 0.305: P1.C31 P3.C31 17.77,86.83 19.04,88.1 27.93,88.1 29.2,86.83 P4.C31 38.73,86.83 40,88.1 48.26,88.1 49.53,86.83 P2.C31
BA0  (via drill 0.6)  (2 unrouted)
  Top 0.406: v128.27,69.05 128.27,58.02 127.47,57.22 v127.47,39.84
  Bottom 0.254: 40,67.78 53.34,67.78 | v128.27,69.05 149.78,69.05 X1.Y
  Bottom 0.305: P1.C23 P3.C23 18.41,66.51 19.68,67.78 27.3,67.78 28.57,66.51 P4.C23 38.73,66.51 40,67.78 | 53.34,67.78 54.61,66.51 P2.C23 59.05,66.51 60.32,67.78 73.66,67.78 74.29,68.41 SLOT3.2
  Bottom 0.406: SLOT3.2 80.64,68.41 81.91,69.69 93.34,69.69 94.61,68.41 SLOT5.2 97.78,68.41 99.05,69.69 106.04,69.69 107.31,68.41 SLOT7.2 113.66,68.41 114.93,69.69 120.64,69.69 121.28,69.05 v128.27,69.05 | SLOT6.1.16 v127.47,39.84 128.58,39.84 129.06,39.36 137,39.36 137.47,39.84 SLOT6.2.16
BA1  (via drill 0.6)  (2 unrouted)
  Top 0.406: v129.53,66.51 129.53,65.88 128.9,65.24 128.9,57.38 128.19,56.67 128.19,42.06 128.5,41.11 v128.42,37.38
  Bottom 0.254: 40,65.24 42.94,65.24 43.57,65.88 52.46,65.88 52.54,65.95 53.34,65.24 | v129.53,66.51 149.78,66.51 X1.X
  Bottom 0.305: P1.C22 P3.C22 18.41,63.97 19.68,65.24 27.3,65.24 28.57,63.97 P4.C22 38.73,63.97 40,65.24 | 53.34,65.24 54.61,63.97 P2.C22 59.05,63.97 60.32,65.24 73.66,65.24 74.29,65.88 SLOT3.3
  Bottom 0.406: SLOT3.3 80.64,65.88 81.91,67.14 93.34,67.14 94.61,65.88 SLOT5.3 97.78,65.88 99.05,67.14 106.04,67.14 107.31,65.88 SLOT7.3 113.66,65.88 114.93,67.14 120.64,67.14 121.28,66.51 v129.53,66.51 | SLOT6.1.15 128.82,37.3 | 128.82,37.3 SLOT6.2.15 | v128.42,37.38 128.82,37.3
BA2  (via drill 0.6)  (2 unrouted)
  Top 0.406: v130.17,63.97 129.53,63.34 129.53,56.59 128.98,56.03 128.98,42.38 129.46,40.87 v129.46,35.16
  Bottom 0.254: 40,62.7 53.34,62.7 | v130.17,63.97 149.78,63.97 X1.W
  Bottom 0.305: P1.C21 P3.C21 18.41,61.43 19.68,62.7 27.3,62.7 28.57,61.43 P4.C21 38.73,61.43 40,62.7 | 53.34,62.7 54.61,61.43 P2.C21 59.05,61.43 60.32,62.7 73.66,62.7 74.29,63.34 SLOT3.4
  Bottom 0.406: SLOT3.4 80.64,63.34 81.91,64.61 93.34,64.61 94.61,63.34 SLOT5.4 97.78,63.34 99.05,64.61 105.41,64.61 106.67,63.34 SLOT7.4 113.66,63.34 114.93,64.61 120.64,64.61 121.28,63.97 v130.17,63.97 | SLOT6.1.14 129.93,34.76 | 129.93,34.76 SLOT6.2.14 | v129.46,35.16 129.93,34.76
BA3  (via drill 0.6)  (2 unrouted)
  Top 0.406: v130.65,61.43 130.17,59.52 130.17,56.11 129.69,55.48 129.69,42.62 130.33,41.11 v130.33,32.22
  Bottom 0.254: v130.65,61.43 149.78,61.43 X1.V
  Bottom 0.305: P1.C20 P3.C20 18.41,58.89 19.68,60.16 27.3,60.16 28.57,58.89 P4.C20 38.73,58.89 40,60.16 53.34,60.16 54.61,58.89 P2.C20 59.05,58.89 60.32,60.16 73.66,60.16 74.29,60.8 SLOT3.5
  Bottom 0.406: SLOT3.5 80.64,60.8 81.91,62.06 92.7,62.06 93.97,60.8 SLOT5.5 97.78,60.8 99.05,62.06 105.41,62.06 106.67,60.8 SLOT7.5 113.66,60.8 114.93,62.06 120.64,62.06 121.28,61.43 v130.65,61.43 | SLOT6.2.13 v130.33,32.22 SLOT6.1.13
BA4  (via drill 0.6)  (2 unrouted)
  Top 0.305: IC4.1 69.84,56.98 v70.48,57.62
  Top 0.406: v132.87,58.89 132.87,53.17 132.95,52.62 132.95,48.17 135.25,45.55 135.25,38.57 134.46,37.62 134.46,31.11 133.98,30.63 v133.98,29.68
  Bottom 0.254: v132.87,58.89 149.78,58.89 X1.U
  Bottom 0.305: P1.C19 P3.C19 18.41,56.35 19.68,57.62 27.3,57.62 28.57,56.35 P4.C19 38.73,56.35 40,57.62 53.34,57.62 54.61,56.35 P2.C19 59.05,56.35 60.32,57.62 v70.48,57.62 73.66,57.62 74.29,58.25 SLOT3.6
  Bottom 0.406: SLOT3.6 80.64,58.25 81.91,59.52 92.7,59.52 93.97,58.25 SLOT5.6 97.78,58.25 99.05,59.52 105.41,59.52 106.67,58.25 SLOT7.6 113.66,58.25 114.93,59.52 120.01,59.52 120.64,58.89 v132.87,58.89 | SLOT6.2.12 v133.98,29.68 SLOT6.1.12
BA5  (via drill 0.6)  (2 unrouted)
  Top 0.305: IC4.2 69.84,55.71 v70.48,55.08
  Top 0.406: v133.98,56.35 133.5,54.84 133.5,53.57 133.74,53.02 133.74,48.57 135.88,46.19 135.88,37.3 135.25,36.66 v135.25,27.14
  Bottom 0.254: v133.98,56.35 149.78,56.35 X1.T
  Bottom 0.305: P1.C18 P3.C18 18.41,53.81 19.68,55.08 27.3,55.08 28.57,53.81 P4.C18 38.73,53.81 40,55.08 47.94,55.08 48.33,54.68 53.02,54.68 53.97,53.81 P2.C18 59.05,53.81 60.32,55.08 v70.48,55.08 73.66,55.08 74.29,55.71 SLOT3.7
  Bottom 0.406: SLOT3.7 80.64,55.71 81.91,56.98 92.7,56.98 93.97,55.71 SLOT5.7 97.78,55.71 99.05,56.98 105.41,56.98 106.67,55.71 SLOT7.7 113.66,55.71 114.93,56.98 120.01,56.98 120.64,56.35 v133.98,56.35 | SLOT6.1.11 v135.25,27.14 SLOT6.2.11
BA6  (via drill 0.6)  (2 unrouted)
  Top 0.305: IC4.3 69.21,54.45 v70.16,52.54
  Top 0.406: v134.46,53.81 134.46,49.37 136.52,46.82 v136.52,24.6
  Bottom 0.254: X1.S 136.92,54.05 136.44,54.45 135.09,54.45 v134.46,53.81
  Bottom 0.305: P1.C17 P3.C17 18.41,51.27 19.68,52.54 27.3,52.54 28.57,51.27 P4.C17 38.73,51.27 40,52.54 47.3,52.54 47.7,52.14 52.78,52.14 53.65,51.27 P2.C17 59.37,51.27 60.48,52.3 66.99,52.3 67.3,52.54 v70.16,52.54 73.66,52.54 74.29,53.17 SLOT3.8
  Bottom 0.406: SLOT3.8 80.64,53.17 81.91,54.45 92.07,54.45 93.34,53.17 SLOT5.8 97.78,53.17 99.05,54.45 105.41,54.45 106.67,53.17 SLOT7.8 113.66,53.17 114.93,54.45 120.01,54.45 120.64,53.81 v134.46,53.81 | SLOT6.1.10 v136.52,24.6 SLOT6.2.10
BA7  (via drill 0.6)  (2 unrouted)
  Top 0.305: IC4.6 70.16,50.63 v70.8,50
  Top 0.406: v122.55,51.27 122.55,22.7 123.19,22.06 SLOT6.1.9
  Bottom 0.254: X1.R 145.65,51.67 145.01,51.03 142,51.03 141.68,51.35 136.52,51.35 135.96,50.79 126.99,50.79 126.52,51.27 v122.55,51.27
  Bottom 0.305: P2.C16 59.05,48.73 60.32,50 v70.8,50 73.66,50 74.29,50.63 SLOT3.9 | 40,50 46.98,50 47.62,49.37 51.43,49.37 52.07,50 52.7,50
  Bottom 0.406: P1.C16 P3.C16 18.41,48.73 19.68,50 27.3,50 28.57,48.73 P4.C16 38.73,48.73 40,50 | 52.7,50 53.97,48.73 P2.C16 | SLOT3.9 80.64,50.63 81.91,51.91 92.07,51.91 93.34,50.63 SLOT5.9 97.78,50.63 99.05,51.91 105.41,51.91 106.67,50.63 SLOT7.9 113.66,50.63 114.93,51.91 120.01,51.91 120.64,51.27 v122.55,51.27 | SLOT6.2.9 SLOT6.1.9 124.45,22.06
BA8  (via drill 0.5, 0.6)  (2 unrouted)
  Top 0.254: v121.04,47.62 121.84,47.62 121.91,47.7
  Top 0.305: IC3.1 67.3,44.28 66.67,44.92 v66.67,46.82
  Top 0.406: v121.28,49.37 121.91,48.73 121.91,47.7 121.91,20.15 122.55,19.52 SLOT6.1.8
  Bottom 0.254: 46.35,48.09 52.07,48.09 | X1.P 148.98,49.13 148.66,48.81 124.14,48.81 122.95,47.62 v121.04,47.62
  Bottom 0.305: P2.C15 59.05,46.19 60.32,47.46 66.67,47.46 | 66.67,47.46 73.66,47.46 74.29,48.09 SLOT3.10 | v66.67,46.82 66.67,47.46 | 40,47.46 45.72,47.46 46.35,48.09 | 52.07,48.09 52.7,47.46
  Bottom 0.406: P1.C15 P3.C15 | 17.14,46.19 P3.C15 | P3.C15 18.41,46.19 19.68,47.46 27.3,47.46 28.57,46.19 P4.C15 38.73,46.19 40,47.46 | 52.7,47.46 53.97,46.19 P2.C15 | SLOT3.10 80.64,48.09 81.91,49.37 90.8,49.37 92.07,48.09 SLOT5.10 98.42,48.09 99.69,49.37 105.41,49.37 106.67,48.09 SLOT7.10 113.66,48.09 114.93,49.37 v121.28,49.37 | SLOT6.1.8 129.22,19.52 129.38,19.36 130.96,19.36 131.12,19.52 SLOT6.2.8
BA9  (via drill 0.6)  (2 unrouted)
  Top 0.305: IC3.2 69.21,43.02 70.08,43.65 v70.08,44.28
  Top 0.406: v119.93,46.82 121.28,46.19 121.28,17.61 121.91,16.98 SLOT6.1.7
  Bottom 0.254: 46.67,45.24 52.38,45.24 | X1.N 149.46,46.59 148.98,46.11 123.66,46.11 122.95,46.82 v119.93,46.82
  Bottom 0.305: P2.C14 58.41,43.65 59.92,45.16 64.37,45.16 64.45,45.24 70.16,45.24 | 70.16,45.24 73.66,45.24 74.29,45.55 SLOT3.11 | 70.16,45.24 v70.08,44.28 | 40,44.92 46.35,44.92 46.67,45.24 | 52.38,45.24 52.7,44.92
  Bottom 0.406: P1.C14 P3.C14 18.41,43.65 19.68,44.92 27.3,44.92 28.57,43.65 P4.C14 38.73,43.65 40,44.92 | 52.7,44.92 53.97,43.65 P2.C14 | SLOT3.11 80.64,45.55 81.91,46.82 90.8,46.82 92.07,45.55 SLOT5.11 | 96.52,45.55 SLOT5.11 | SLOT5.11 97.78,45.55 99.05,46.82 105.41,46.82 106.67,45.55 SLOT7.11 113.66,45.55 114.93,46.82 v119.93,46.82 | SLOT6.2.7 SLOT6.1.7
BA10  (via drill 0.6)  (2 unrouted)
  Top 0.254: 120.64,43.65 120.57,43.57
  Top 0.305: IC3.3 v70.08,42.38
  Top 0.406: v120.01,44.28 120.64,43.65 120.64,15.71 121.91,14.44 SLOT6.1.6
  Bottom 0.254: X1.M 149.54,44.05 149.14,43.65 136.28,43.65 135.09,42.46 132.47,42.46 131.28,43.65 120.64,43.65 v120.01,44.28
  Bottom 0.305: P2.C13 59.53,41.11 60.8,42.38 63.81,42.38 64.13,42.7 69.77,42.7 v70.08,42.38 73.66,42.38 74.29,43.02 SLOT3.12 | 52.7,42.38 40,42.38
  Bottom 0.406: P1.C13 P3.C13 18.41,41.11 19.68,42.38 27.3,42.38 28.57,41.11 P4.C13 38.73,41.11 40,42.38 | 52.7,42.38 53.97,41.11 P2.C13 | SLOT3.12 80.64,43.02 81.91,44.28 90.8,44.28 92.07,43.02 SLOT5.12 97.78,43.02 99.05,44.28 105.41,44.28 106.67,43.02 SLOT7.12 113.66,43.02 114.93,44.28 v120.01,44.28 | SLOT6.1.6 SLOT6.2.6
BA11  (via drill 0.6)  (2 unrouted)
  Top 0.305: IC5.1 66.99,31.58 65.72,32.85 v65.72,38.65
  Top 0.406: v119.38,41.74 120.01,41.11 120.01,14.44 122.55,11.9 SLOT6.1.5
  Bottom 0.254: v65.72,38.65 66.03,39.52 66.35,39.84 | X1.L 149.54,41.51 149.14,41.11 137.55,41.11 136.68,40 129.3,40 128.19,41.19 119.93,41.19 v119.38,41.74
  Bottom 0.305: P2.C12 58.65,38.57 59.92,39.84 66.35,39.84 73.66,39.84 74.29,40.48 SLOT3.13 | 40,39.84 43.18,39.84 43.81,39.2 53.34,39.2
  Bottom 0.406: P1.C12 P3.C12 18.41,38.57 19.68,39.84 27.3,39.84 28.57,38.57 P4.C12 38.73,38.57 40,39.84 | 53.34,39.2 53.97,38.57 P2.C12 | SLOT3.13 80.64,40.48 81.91,41.74 90.8,41.74 92.07,40.48 SLOT5.13 97.78,40.48 99.05,41.74 105.41,41.74 106.67,40.48 SLOT7.13 113.66,40.48 114.93,41.74 v119.38,41.74 | SLOT6.2.5 SLOT6.1.5
BA12  (via drill 0.6)  (2 unrouted)
  Top 0.406: v118.74,39.2 119.38,38.57 119.38,11.9 121.91,9.36 SLOT6.1.4 | IC5.2 66.03,30.31 66.03,31.58 64.77,32.54 v64.77,37.54
  Bottom 0.254: P2.C11 57.94,36.03 59.45,37.54 v64.77,37.54 | X1.K 149.54,38.97 149.14,38.57 119.38,38.57 v118.74,39.2
  Bottom 0.305: 64.61,37.3 v64.77,37.54 64.92,37.62 66.91,37.62 68.5,39.2 74.05,39.2 74.92,39.84 76.83,39.84 SLOT3.14 | 52.7,37.3 40,37.3
  Bottom 0.406: P1.C11 P3.C11 18.41,36.03 19.68,37.3 27.3,37.3 28.57,36.03 P4.C11 38.73,36.03 40,37.3 | 52.7,37.3 53.97,36.03 P2.C11 | SLOT3.14 80.64,37.94 81.91,39.2 90.8,39.2 92.07,37.94 SLOT5.14 97.78,37.94 99.05,39.2 105.41,39.2 106.67,37.94 SLOT7.14 113.66,37.94 114.93,39.2 v118.74,39.2 | SLOT6.1.4 126.99,9.36 128.27,10.63 133.98,10.63 135.25,9.36 SLOT6.2.4
BA13  (via drill 0.5, 0.6)  (2 unrouted)
  Top 0.254: IC5.4 64.77,27.77 64.13,28.41 64.13,31.9 63.81,32.22 v63.81,34.76 | IC9.1 145.41,95.72 145.09,95.4 145.09,86.04 144.3,85.24 144.3,77.46 144.62,77.15 144.62,42.38 142.87,40.63 v142.87,36.66
  Top 0.406: SLOT6.2.3 137.16,6.82 133.34,10.63 128.27,10.63 126.99,9.36 126.99,8.73 SLOT6.1.3 122.55,6.82 118.74,10.63 118.74,36.66 v118.1,36.66
  Bottom 0.254: X1.J 149.54,36.43 149.22,36.11 142.87,36.11 | 142.87,36.11 118.66,36.11 v118.1,36.66 | v142.87,36.66 142.87,36.11
  Bottom 0.305: 40,34.76 52.7,34.76
  Bottom 0.406: P1.C10 P3.C10 18.41,33.49 19.68,34.76 27.3,34.76 28.57,33.49 P4.C10 38.73,33.49 40,34.76 | 52.7,34.76 53.97,33.49 P2.C10 59.37,33.49 60.64,34.76 v63.81,34.76 73.66,34.76 74.29,35.39 SLOT3.15 82.55,35.39 83.81,36.66 91.44,36.66 92.7,35.39 SLOT5.15 97.78,35.39 99.05,36.66 105.41,36.66 106.67,35.39 SLOT7.15 113.66,35.39 114.93,36.66 v118.1,36.66
BA14  (via drill 0.5, 0.6)  (2 unrouted)
  Top 0.254: SLOT6.2.2 143.03,4.28 143.27,4.52 143.27,8.17 143.82,8.73 143.82,10.63 143.35,11.11 143.27,32.7 v143.35,32.78 143.03,33.09 143.03,35.55 143.66,36.19 143.66,36.98 143.35,37.3 143.35,40.48 145.09,42.22 145.09,77.3 144.78,77.62 144.78,85.08 145.57,85.88 145.57,94.13 145.89,94.45 IC9.2
  Top 0.406: SLOT6.1.2 127.63,1.74 133.98,1.74 136.52,4.28 SLOT6.2.2 142.87,4.28 | IC5.3 66.03,29.04 65.4,29.68 v65.08,29.68
  Bottom 0.254: P4.C9 38.73,30.95 40,32.22 52.7,32.22 53.97,30.95 P2.C9 | X1.H 149.46,33.89 149.06,33.49 143.5,33.49 | 143.5,33.49 139.06,33.49 | v143.35,32.78 143.35,33.33 143.5,33.49
  Bottom 0.406: P1.C9 P3.C9 18.41,30.95 19.68,32.22 27.3,32.22 28.57,30.95 P4.C9 | P2.C9 59.05,30.95 60.32,32.22 65.08,32.22 | 139.06,33.49 138.42,34.12 130.81,34.12 130.17,33.49 121.28,33.49 120.64,34.12 114.93,34.12 113.66,32.85 SLOT7.16 106.67,32.85 105.41,34.12 99.05,34.12 97.78,32.85 SLOT5.16 93.34,32.85 92.07,34.12 81.91,34.12 80.64,32.85 SLOT3.16 75.24,32.85 74.61,32.22 65.08,32.22 | v65.08,29.68 65.08,32.22
BA15  (via drill 0.5, 0.6)  (2 unrouted)
  Top 0.254: v82.78,31.43 83.26,31.43 83.58,31.58 85.32,31.58 85.72,31.98 86.43,31.98 v86.67,31.74 | IC5.6 66.99,25.23 66.35,25.87 66.35,26.82 66.67,27.14 70.16,27.14 v70.16,29.68 | SLOT6.2.1 143.58,1.74 144.62,2.77 144.62,30.24 v144.54,30.31 144.46,30.39 144.46,32.06 144.62,32.22 144.62,40.16 146.68,42.22 146.68,79.84 146.04,80.48 146.04,93.02 146.2,93.18 IC9.3
  Top 0.406: 143.5,1.74 SLOT6.2.1
  Bottom 0.254: P4.C8 37.94,28.41 39.21,29.68 | SLOT3.17 80.88,30.31 v82.78,31.43 | v86.67,31.74 89.61,29.92 93.9,29.92 94.29,30.31 SLOT5.17 | 52.7,29.68 53.97,28.41 P2.C8 | X1.F 149.54,31.35 149.14,30.95 144.54,30.95 | 144.54,30.95 137.79,30.95 | v144.54,30.31 144.54,30.95
  Bottom 0.305: 39.21,29.68 52.7,29.68
  Bottom 0.406: P1.C8 P3.C8 18.41,28.41 19.68,29.68 27.3,29.68 28.57,28.41 P4.C8 | SLOT5.17 97.78,30.31 99.05,31.58 105.41,31.58 106.67,30.31 SLOT7.17 113.66,30.31 114.93,31.58 120.64,31.58 121.28,30.95 133.34,30.95 133.98,31.58 137.16,31.58 137.79,30.95 | SLOT6.2.1 SLOT6.1.1 | P2.C8 59.05,28.41 60.32,29.68 62.54,29.68 63.5,28.73 69.21,28.73 v70.16,29.68 73.97,29.68 74.61,30.31 SLOT3.17
BA16  (via drill 0.6)  (2 unrouted)
  Top 0.254: IC7.3 28.25,25.23 28.57,25.55 v28.89,25.55
  Top 0.305: 64.13,24.6 64.77,23.96 64.77,22.06 65.4,21.42 65.4,20.79
  Top 0.406: IC2.1 67.3,18.88 65.4,20.79 | 64.13,24.6 58.41,24.6 P2.C7
  Bottom 0.254: P4.C7 39.37,25.87 40.4,26.9 46.11,26.9 46.35,26.66 50.08,26.66 50.56,27.14 52.7,27.14 53.97,25.87 P2.C7 | v28.89,25.55 28.57,25.87
  Bottom 0.406: P1.C7 P3.C7 18.41,25.87 19.68,27.14 27.3,27.14 28.57,25.87 P4.C7
BA17  (via drill 0.6)  (2 unrouted)
  Top 0.254: IC7.11 30.16,23.96 v29.84,23.65
  Top 0.406: IC2.2 66.67,17.61 64.13,20.15 64.13,21.42 63.5,22.06 58.41,22.06 P2.C6
  Bottom 0.254: P4.C6 39.05,23.33 40.32,24.6 52.38,24.6 53.65,23.33 P2.C6 | v29.84,23.65 29.52,23.33
  Bottom 0.406: P1.C6 P3.C6 18.41,23.33 19.68,24.6 27.3,24.6 28.57,23.33 29.52,23.33 P4.C6
BA18  (via drill 0.6)  (2 unrouted)
  Top 0.254: IC7.6 28.89,21.42 v29.2,21.11
  Top 0.406: IC2.3 66.67,16.34 63.5,19.52 58.41,19.52 P2.C5
  Bottom 0.254: 40,22.06 52.07,22.06 53.34,20.79 P2.C5 | v29.2,21.11 29.2,20.79
  Bottom 0.406: P1.C5 P3.C5 18.41,20.79 19.68,22.06 27.3,22.06 28.57,20.79 29.2,20.79 P4.C5 38.73,20.79 40,22.06
BA19  (via drill 0.6)  (2 unrouted)
  Top 0.254: IC7.8 30.79,20.15 30.16,19.52 v30.16,18.57
  Top 0.406: IC2.4 66.03,15.08 64.13,16.98 58.41,16.98 P2.C4
  Bottom 0.254: P2.C4 53.65,18.25 52.38,19.52 40,19.52 | v30.16,18.57 30.16,18.25
  Bottom 0.406: P1.C4 P3.C4 18.41,18.25 19.68,19.52 27.3,19.52 28.57,18.25 30.16,18.25 P4.C4 38.73,18.25 40,19.52
BD0  (via drill 0.6)  (2 unrouted)
  Top 0.305: P2.A22 64.13,65.88 v64.13,66.51
  Bottom 0.254: SLOT6.2.27 146.84,67.78 147.08,68.02 147.24,68.02 147.39,68.18 153.98,68.18 X1.21
  Bottom 0.305: P1.A22 6.98,63.97 8.25,62.7 18.41,62.7 19.68,63.97 P3.A22 27.3,63.97 28.57,62.7 38.73,62.7 40,63.97 P4.A22 53.34,63.97 54.61,62.7 59.05,62.7 60.32,63.97 P2.A22 | v64.13,66.51 73.66,66.51 74.29,67.14 80.64,67.14 81.91,68.41 SLOT3.B 93.34,68.41
  Bottom 0.406: 93.34,68.41 94.61,67.14 97.78,67.14 99.05,68.41 SLOT5.B 106.04,68.41 107.31,67.14 113.66,67.14 114.93,68.41 SLOT7.B 120.64,68.41 121.28,67.78 SLOT6.1.27 SLOT6.2.27
BD1  (via drill 0.5, 0.6)  (2 unrouted)
  Top 0.254: v157.08,70.8 157.08,68.73 X1.20
  Top 0.305: P2.A21 64.13,63.34 v64.13,63.97
  Top 0.406: v114.85,72.78 114.93,72.54 114.93,66.51 115.56,65.88 SLOT7.C
  Bottom 0.254: SLOT6.2.28 146.92,70.32 147.47,70.88 157,70.88 v157.08,70.8
  Bottom 0.305: P1.A21 6.98,61.43 8.25,60.16 18.41,60.16 19.68,61.43 P3.A21 27.3,61.43 28.57,60.16 38.73,60.16 40,61.43 P4.A21 53.34,61.43 54.61,60.16 59.05,60.16 60.32,61.43 P2.A21 | v64.13,63.97 73.66,63.97 74.29,64.61 80.64,64.61 81.91,65.88 SLOT3.C 93.34,65.88
  Bottom 0.406: 93.34,65.88 94.61,64.61 97.78,64.61 99.05,65.88 SLOT5.C 105.41,65.88 106.67,64.61 113.66,64.61 114.93,65.88 SLOT7.C | SLOT6.2.28 SLOT6.1.28 123.82,70.32 120.96,72.78 v114.85,72.78
BD2  (via drill 0.5, 0.6)  (2 unrouted)
  Top 0.254: v157,73.57 157,72.38 157.87,71.51 157.87,66.99 X1.19
  Top 0.305: P2.A20 64.13,60.8 v64.13,61.43
  Top 0.406: v114.3,74.53 113.66,74.13 113.66,63.97 114.3,63.34 SLOT7.D
  Bottom 0.254: SLOT6.2.29 147.31,72.86 147.71,73.26 147.79,73.26 148.11,73.57 v157,73.57
  Bottom 0.305: P1.A20 6.98,58.89 8.25,57.62 18.41,57.62 19.68,58.89 P3.A20 27.3,58.89 28.57,57.62 38.73,57.62 40,58.89 P4.A20 53.34,58.89 54.61,57.62 59.05,57.62 60.32,58.89 P2.A20 | v64.13,61.43 73.66,61.43 74.29,62.06 80.64,62.06 81.91,63.34 SLOT3.D 93.34,63.34
  Bottom 0.406: 93.34,63.34 94.61,62.06 97.78,62.06 99.05,63.34 SLOT5.D 105.41,63.34 106.67,62.06 113.66,62.06 114.93,63.34 SLOT7.D | SLOT6.2.29 SLOT6.1.29 123.5,72.86 121.76,74.21 116.04,74.21 115.49,74.53 v114.3,74.53
BD3  (via drill 0.5, 0.6)  (2 unrouted)
  Top 0.254: v157.55,74.77 157.55,74.69 158.11,74.13 158.11,72.3 158.35,72.07 158.35,64.92 X1.18
  Top 0.305: P2.A19 64.13,58.25 v64.13,58.89
  Top 0.406: SLOT6.1.30 122.55,75.4 121.91,74.77 121.91,60.8 v122.55,60.16
  Bottom 0.254: SLOT6.2.30 146.44,75.4 147,74.84 157.47,74.84 v157.55,74.77
  Bottom 0.305: P1.A19 6.98,56.35 8.25,55.08 18.41,55.08 19.68,56.35 P3.A19 27.3,56.35 28.57,55.08 38.73,55.08 40,56.35 P4.A19 47.22,56.35 47.86,56.98 52.07,56.98 53.97,55.08 59.05,55.08 60.32,56.35 P2.A19 | v64.13,58.89 73.66,58.89 74.29,59.52 80.64,59.52 81.91,60.8 SLOT3.E 92.7,60.8
  Bottom 0.406: 92.7,60.8 93.97,59.52 97.78,59.52 99.05,60.8 SLOT5.E 105.41,60.8 106.67,59.52 113.66,59.52 114.93,60.8 SLOT7.E 120.01,60.8 120.64,60.16 v122.55,60.16 | SLOT6.1.30 126.68,75.4 127.31,74.77 139.06,74.77 139.62,75.32 SLOT6.2.30
BD4  (via drill 0.5, 0.6)  (2 unrouted)
  Top 0.254: X1.17 155.09,59.29 153.98,60.56 153.98,77.7 v153.74,77.94
  Top 0.305: P2.A18 64.13,55.71 v64.13,56.35
  Top 0.406: SLOT6.1.31 124.38,77.94 123.34,78.97 122.31,78.97 121.28,77.3 121.28,58.25 v121.91,57.62
  Bottom 0.254: v153.74,77.94 SLOT6.2.31
  Bottom 0.305: P1.A18 6.98,53.81 8.25,52.54 18.41,52.54 19.68,53.81 P3.A18 27.3,53.81 28.57,52.54 38.73,52.54 40,53.81 P4.A18 47.62,53.81 48.02,54.21 52.62,54.21 54.13,52.78 58.89,52.78 60,53.81 P2.A18 | v64.13,56.35 73.66,56.35 74.29,56.98 80.64,56.98 81.91,58.25 SLOT3.F 92.7,58.25
  Bottom 0.406: 92.7,58.25 93.97,56.98 97.78,56.98 99.05,58.25 SLOT5.F 105.41,58.25 106.67,56.98 113.66,56.98 114.93,58.25 SLOT7.F 120.01,58.25 120.64,57.62 v121.91,57.62 | SLOT6.1.31 128.58,77.94 128.9,77.62 133.03,77.62 133.34,77.94 SLOT6.2.31
BD5  (via drill 0.5, 0.6)  (2 unrouted)
  Top 0.254: X1.16 154.54,56.75 153.43,58.18 153.43,76.99 152.79,77.62 152.79,80.4 v153.03,80.48
  Top 0.305: P2.A17 64.13,53.17 v64.13,53.81
  Top 0.406: SLOT6.1.32 122.55,80.48 120.64,79.84 120.64,55.71 v121.91,55.08
  Bottom 0.254: v153.03,80.48 SLOT6.2.32
  Bottom 0.305: P1.A17 6.98,51.27 8.25,50 18.41,50 19.68,51.27 P3.A17 27.3,51.27 28.57,50 38.73,50 40,51.27 P4.A17 47.62,51.27 48.1,51.67 52.22,51.67 53.97,50 59.05,50 60.32,51.27 P2.A17 | v64.13,53.81 65.4,53.81 65.72,54.13 67.62,54.13 67.94,53.81 73.66,53.81 74.29,54.45 80.64,54.45 81.91,55.71 SLOT3.G 92.7,55.71
  Bottom 0.406: 92.7,55.71 93.97,54.45 97.78,54.45 99.05,55.71 SLOT5.G 105.41,55.71 106.67,54.45 113.66,54.45 114.93,55.71 SLOT7.G 119.38,55.71 120.01,55.08 v121.91,55.08 | SLOT6.1.32 SLOT6.2.32
BD6  (via drill 0.5, 0.6)  (2 unrouted)
  Top 0.254: v152.32,54.13 152.24,54.13 151.92,54.45 151.92,56.03 152.39,56.51 152.32,76.51 151.28,77.38 v151.28,83.02
  Top 0.305: P2.A16 64.13,50.63 v64.13,51.27
  Top 0.406: SLOT6.1.33 121.28,83.02 120.01,82.39 120.01,53.49 120.88,52.62 v120.88,52.54
  Bottom 0.254: P4.A16 52.7,48.73 | X1.15 152.24,54.21 v152.32,54.13 | v151.28,83.02 SLOT6.2.33
  Bottom 0.305: v64.13,51.27 73.66,51.27 74.29,51.91 80.64,51.91 81.91,53.17 SLOT3.H 92.07,53.17
  Bottom 0.406: P1.A16 6.98,48.73 8.25,47.46 18.41,47.46 19.68,48.73 P3.A16 27.3,48.73 28.57,47.46 38.73,47.46 40,48.73 P4.A16 | 52.7,48.73 53.97,47.46 59.05,47.46 60.32,48.73 P2.A16 | 92.07,53.17 93.34,51.91 97.78,51.91 99.05,53.17 SLOT5.H 105.41,53.17 106.67,51.91 113.66,51.91 114.93,53.17 SLOT7.H 120.01,53.17 v120.88,52.54 | SLOT6.1.33 127.63,83.02 127.95,82.7 136.2,82.7 136.52,83.02 SLOT6.2.33
BD7  (via drill 0.5, 0.6)  (2 unrouted)
  Top 0.254: v148.43,52.94 148.43,73.18 149.06,73.81 149.06,76.99 148.43,77.62 148.43,85.48 v148.51,85.56
  Top 0.305: P2.A15 64.13,48.09 v64.13,48.73
  Top 0.406: SLOT6.1.34 121.6,85.56 120.96,84.92 119.69,84.92 119.38,84.61 v119.38,50.63
  Bottom 0.254: 46.67,46.19 47.14,45.71 53.18,45.71 53.97,44.92 | X1.14 152.79,51.67 151.52,52.94 v148.43,52.94 | v148.51,85.56 SLOT6.2.34
  Bottom 0.305: 92.07,50.63 SLOT3.J 81.91,50.63 80.64,49.37 74.29,49.37 73.66,48.73 v64.13,48.73
  Bottom 0.406: P1.A15 6.98,46.19 8.25,44.92 18.41,44.92 19.68,46.19 P3.A15 27.3,46.19 28.57,44.92 38.73,44.92 40,46.19 P4.A15 46.67,46.19 | 53.97,44.92 58.73,44.92 60,46.19 P2.A15 | 92.07,50.63 93.34,49.37 97.78,49.37 99.05,50.63 SLOT5.J 105.41,50.63 106.67,49.37 113.66,49.37 114.93,50.63 SLOT7.J v119.38,50.63 | SLOT6.1.34 126.68,85.56 126.99,85.24 132.23,85.24 132.55,85.56 134.93,85.56 135.57,84.92 136.84,84.92 137.47,85.56 SLOT6.2.34
BPHI0  (2 unrouted)
  Bottom 0.305: P1.C28 P3.C28 18.41,79.21 19.68,80.48 27.93,80.48 29.2,79.21 P4.C28 38.1,79.21 39.37,80.48 48.26,80.48 49.53,79.21 P2.C28
BPHI1  (via drill 0.6)  (2 unrouted)
  Top 0.305: v92.07,79.53 92.07,74.53 91.51,73.97 91.51,69.92 91.99,69.45 92.07,40.48 v92.7,39.36
  Bottom 0.305: P1.C27 P3.C27 18.41,76.67 19.68,77.94 27.93,77.94 29.2,76.67 P4.C27 38.73,76.67 40,77.94 53.34,77.94 54.61,76.67 P2.C27 58.41,76.67 59.69,77.94 63.5,77.94 64.61,78.97 77.86,78.97 78.73,79.84 90.16,79.84 v92.07,79.53 | v92.7,39.36 92.7,39.2
  Bottom 0.406: SLOT3.N 90.8,40.48 92.07,39.2 92.7,39.2 97.78,39.2 99.05,40.48 SLOT5.N 105.41,40.48 106.67,39.2 113.66,39.2 114.93,40.48 SLOT7.N
BPHI2  (via drill 0.5, 0.6)  (2 unrouted)
  Top 0.254: 109.21,88.1 108.58,87.47 108.58,86.19 109.21,85.56 | v113.66,26.5 v113.66,44.28
  Top 0.305: SLOT5.L 101.59,45.55 103.5,47.46 103.58,69.92 104.13,70.48 104.13,75 103.82,75.32 v103.82,76.27 v103.42,80.08 | v108.58,85.24 108.9,85.56 109.21,85.56 IC6.4 112.39,85.56 v114.3,86.04 115.09,86.83 IC6.12 | v114.3,83.02 IC6.9 | 109.21,88.1 IC6.2
  Bottom 0.254: X1.E 148.11,28.81 147.39,28.09 119.45,28.09 117.95,26.58 113.74,26.58 v113.66,26.5
  Bottom 0.305: P1.C26 P3.C26 18.41,74.13 19.68,75.4 27.93,75.4 29.2,74.13 P4.C26 38.73,74.13 40,75.4 53.34,75.4 54.61,74.13 P2.C26 58.41,74.13 59.69,75.4 64.13,75.4 66.75,77.86 78.5,77.86 79.21,78.58 90.8,78.58 91.44,77.94 100.56,77.94 101.2,77.3 101.75,77.3 102.79,76.27 v103.82,76.27 | v108.58,85.24 108.58,83.42 108.9,83.1 108.9,80.8 108.18,80.08 v103.42,80.08 | v114.3,86.04 v114.3,83.02
  Bottom 0.406: SLOT3.L 90.8,45.55 92.07,44.28 97.78,44.28 99.05,45.55 SLOT5.L 105.41,45.55 106.67,44.28 v113.66,44.28 114.93,45.55 SLOT7.L 121.91,45.55 122.55,46.19
COLORREF
  Bottom 0.406: SLOT3.Q 84.85,32.85 85.4,33.41 91.83,33.41 93.66,31.58 97.78,31.58 99.05,32.85 SLOT5.Q 105.41,32.85 106.67,31.58 113.66,31.58 114.93,32.85 SLOT7.Q
GND  (via drill 0.5, 0.6)  (12 unrouted)
  Top 0.254: 66.03,50.63 66.67,50 69.84,50 69.84,48.73 | IC8.5 44.76,32.85 44.13,33.49 44.13,34.44 44.45,34.76 47.94,34.76 48.57,35.39 48.57,36.35 48.26,36.66 IC8.2 | IC7.7 24.44,20.15 | 24.12,22.7 23.81,23.01 | 33.97,25.23 34.29,24.92 34.29,21.74 33.97,21.42 34.29,21.11 34.29,19.2 32.7,17.61 31.43,17.61 28.89,15.08 C1.- | 24.76,30.63 23.17,32.22 | 18.41,17.3 18.09,16.98 | IC4.5 66.03,51.91 | 109.21,81.75 109.21,80.08 109.21,79.21 109.85,78.58 | C11.2 102.02,94.55 102.55,95.08 JP1.1 JP1.2 JP1.3 111.44,95.08 112.71,93.81 112.71,92.01 C12.2 | J1.2 86.35,84.61 | 101.59,93.18 101.91,93.18 | 70.05,35.39 70.27,35.18 | IC3.5 70.8,39.2 71.04,39.52
  Top 0.305: 67.94,47.99 IC4.8 69.21,48.09 | C9.2 70.27,45.77 | 66.03,50.63 66.03,51.91 65.08,52.54 65.08,53.81 66.03,54.76 66.03,57.62 67.3,58.89 C10.2 70.27,72.01 | 70.27,72.01 v70.48,72.22 | C21.- 74.92,72.22 | 70.27,72.01 68.16,72.01 67.3,72.86 60.96,72.86 60.32,73.5 60.32,77.3 P2.A28 P2.A29 P2.A30 P2.A31 P2.A32 | 109.21,81.75 IC6.7 | IC8.7 47.94,30.31 48.26,30.63 48.26,32.54 47.94,32.85 IC8.5 | 69.53,20.79 C7.2 | SLOT3.Z 84.13,10 | v44.76,40.16 44.45,39.52 44.45,36.98 44.76,36.66 45,36.66 IC8.2